# Altium schematic sheet buffer.SchDoc
size A4; SheetNumber: 8; SheetTotal: 12
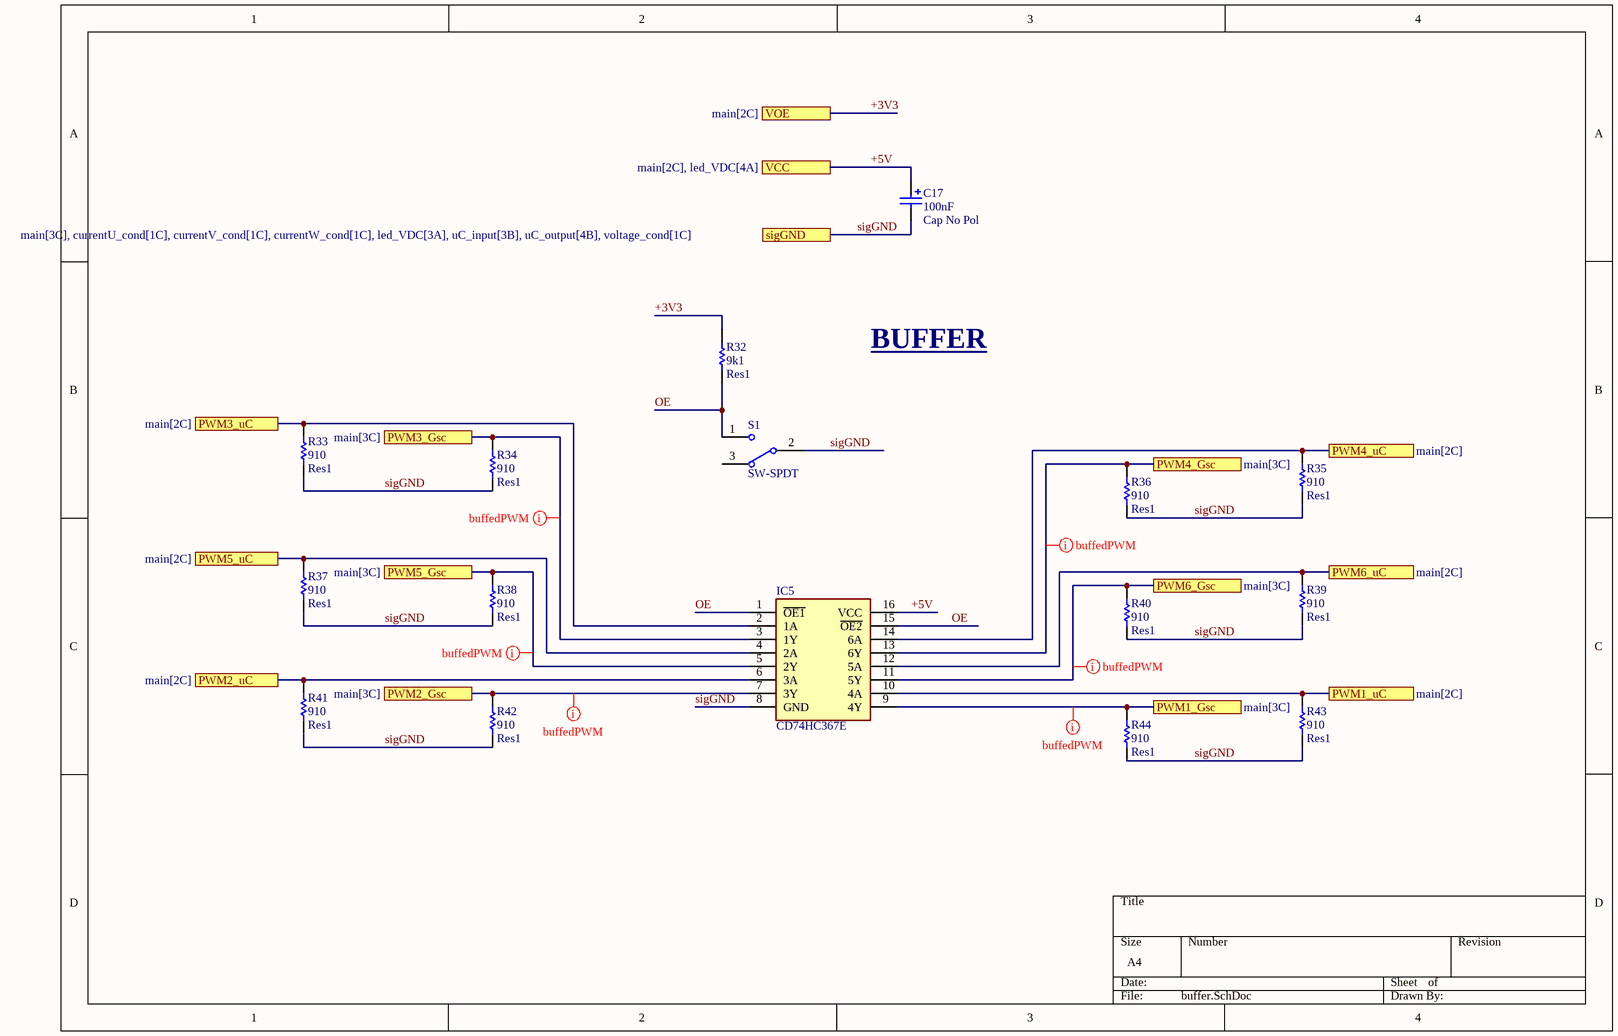
[diagram p0: buffer.SchDoc]

## Parts
C17  Cap No Pol  value 100nF  [RAD-0.1_mod]
IC5  CD74HC367E  [DIP-16_mod]
R32  Res1  value 9k1  [AXIAL-0.3_mod]
R33  Res1  value 910  [AXIAL-0.3_mod]
R34  Res1  value 910  [AXIAL-0.3_mod]
R35  Res1  value 910  [AXIAL-0.3_mod]
R36  Res1  value 910  [AXIAL-0.3_mod]
R37  Res1  value 910  [AXIAL-0.3_mod]
R38  Res1  value 910  [AXIAL-0.3_mod]
R39  Res1  value 910  [AXIAL-0.3_mod]
R40  Res1  value 910  [AXIAL-0.3_mod]
R41  Res1  value 910  [AXIAL-0.3_mod]
R42  Res1  value 910  [AXIAL-0.3_mod]
R43  Res1  value 910  [AXIAL-0.3_mod]
R44  Res1  value 910  [AXIAL-0.3_mod]
S1  SW-SPDT  [MHDR1X3_mod]

## Ports
PWM1_Gsc (see main[3C]), PWM1_uC (see main[2C]), PWM2_Gsc (see main[3C]), PWM2_uC (see main[2C]), PWM3_Gsc (see main[3C]), PWM3_uC (see main[2C]), PWM4_Gsc (see main[3C]), PWM4_uC (see main[2C]), PWM5_Gsc (see main[3C]), PWM5_uC (see main[2C]), PWM6_Gsc (see main[3C]), PWM6_uC (see main[2C]), sigGND (see main[3C], currentU_cond[1C], currentV_cond[1C], currentW_cond[1C], led_VDC[3A], uC_input[3B], uC_output[4B], voltage_cond[1C]), VCC (see main[2C], led_VDC[4A]), VOE (see main[2C])

## Nets
+3V3: R32.2 ; port VOE
+5V: C17.1 IC5.16(VCC) ; port VCC
OE: IC5.1(~{OE1}) IC5.15(~{OE2}) R32.1 S1.1
PWM1_Gsc: IC5.9(4Y) R44.2 ; port PWM1_Gsc
PWM1_uC: IC5.10(4A) R43.2 ; port PWM1_uC
PWM2_Gsc: IC5.7(3Y) R42.2 ; port PWM2_Gsc
PWM2_uC: IC5.6(3A) R41.2 ; port PWM2_uC
PWM3_Gsc: IC5.3(1Y) R34.2 ; port PWM3_Gsc
PWM3_uC: IC5.2(1A) R33.2 ; port PWM3_uC
PWM4_Gsc: IC5.13(6Y) R36.2 ; port PWM4_Gsc
PWM4_uC: IC5.14(6A) R35.2 ; port PWM4_uC
PWM5_Gsc: IC5.5(2Y) R38.2 ; port PWM5_Gsc
PWM5_uC: IC5.4(2A) R37.2 ; port PWM5_uC
PWM6_Gsc: IC5.11(5Y) R40.2 ; port PWM6_Gsc
PWM6_uC: IC5.12(5A) R39.2 ; port PWM6_uC
sigGND: C17.2 IC5.8(GND) R33.1 R34.1 R35.1 R36.1 R37.1 R38.1 R39.1 R40.1 R41.1 R42.1 R43.1 R44.1 S1.2 ; port sigGND

Not connected (* = marked no-connect by the designer): S1 3

## Layout directives
net class buffedPWM: PWM1_Gsc, PWM2_Gsc, PWM3_Gsc, PWM4_Gsc, PWM5_Gsc, PWM6_Gsc

## Notes on the sheet
- BUFFER

## Library data of the parts
C17 = Cap No Pol: Polarized Capacitor (Radial); Published: 8-Jun-2000; LatestRevisionDate: 17-Jul-2002; LatestRevisionNote: Re-released for DXP Platform.; PackageReference: RB7.6-15; Publisher: Altium Limited; PackageDescription: Polarized Capacitor (Radial); 2 Leads
IC5 = CD74HC367E: Integrated Circuit; Manufacturer_Name: Texas Instruments; Datasheet Link: https://www.ti.com/lit/ds/symlink/cd74hc367.pdf?ts=1619589374451&ref_url=https%253A%252F%252Fwww.ti.com%252Fstore%252Fti%252Fen%252Fp%252Fproduct%252F%253Fp%253DCD74HC367E; Height: 5.08mm; Manufacturer_Part_Number: CD74HC367E; Mouser Part Number: 595-CD74HC367E; Mouser Price/Stock: https://www.mouser.co.uk/ProductDetail/Texas-Instruments/CD74HC367E?qs=xFfolx0DHx1dmtXXzN7naA%3D%3D
R32-R44 = Res1: Resistor; Published: 8-Jun-2000; LatestRevisionDate: 17-Jul-2002; LatestRevisionNote: Re-released for DXP Platform.; PackageReference: AXIAL-0.3; Publisher: Altium Limited; PackageDescription: Axial Device, Thru-Hole; 2 Leads; 0.3 in Pin Spacing
S1 = SW-SPDT: SPDT Subminiature Toggle Switch, Right Angle Mounting, Vertical Actuation; Published: 24-Mar-1999; LatestRevisionDate: 17-Dec-2003; LatestRevisionNote: Schematic revised, PCB Footprint replaced.; DatasheetVersion: 05-Dec-2000; PackageReference: TL36WW15050; Publisher: Altium Limited; PackageDescription: Switch; 4 Leads; ComponentLink1Description: Manufacturer Link; ComponentLink1URL: http://www.apem.com